# EAGLE design M706X (EAGLE 6.6.0)
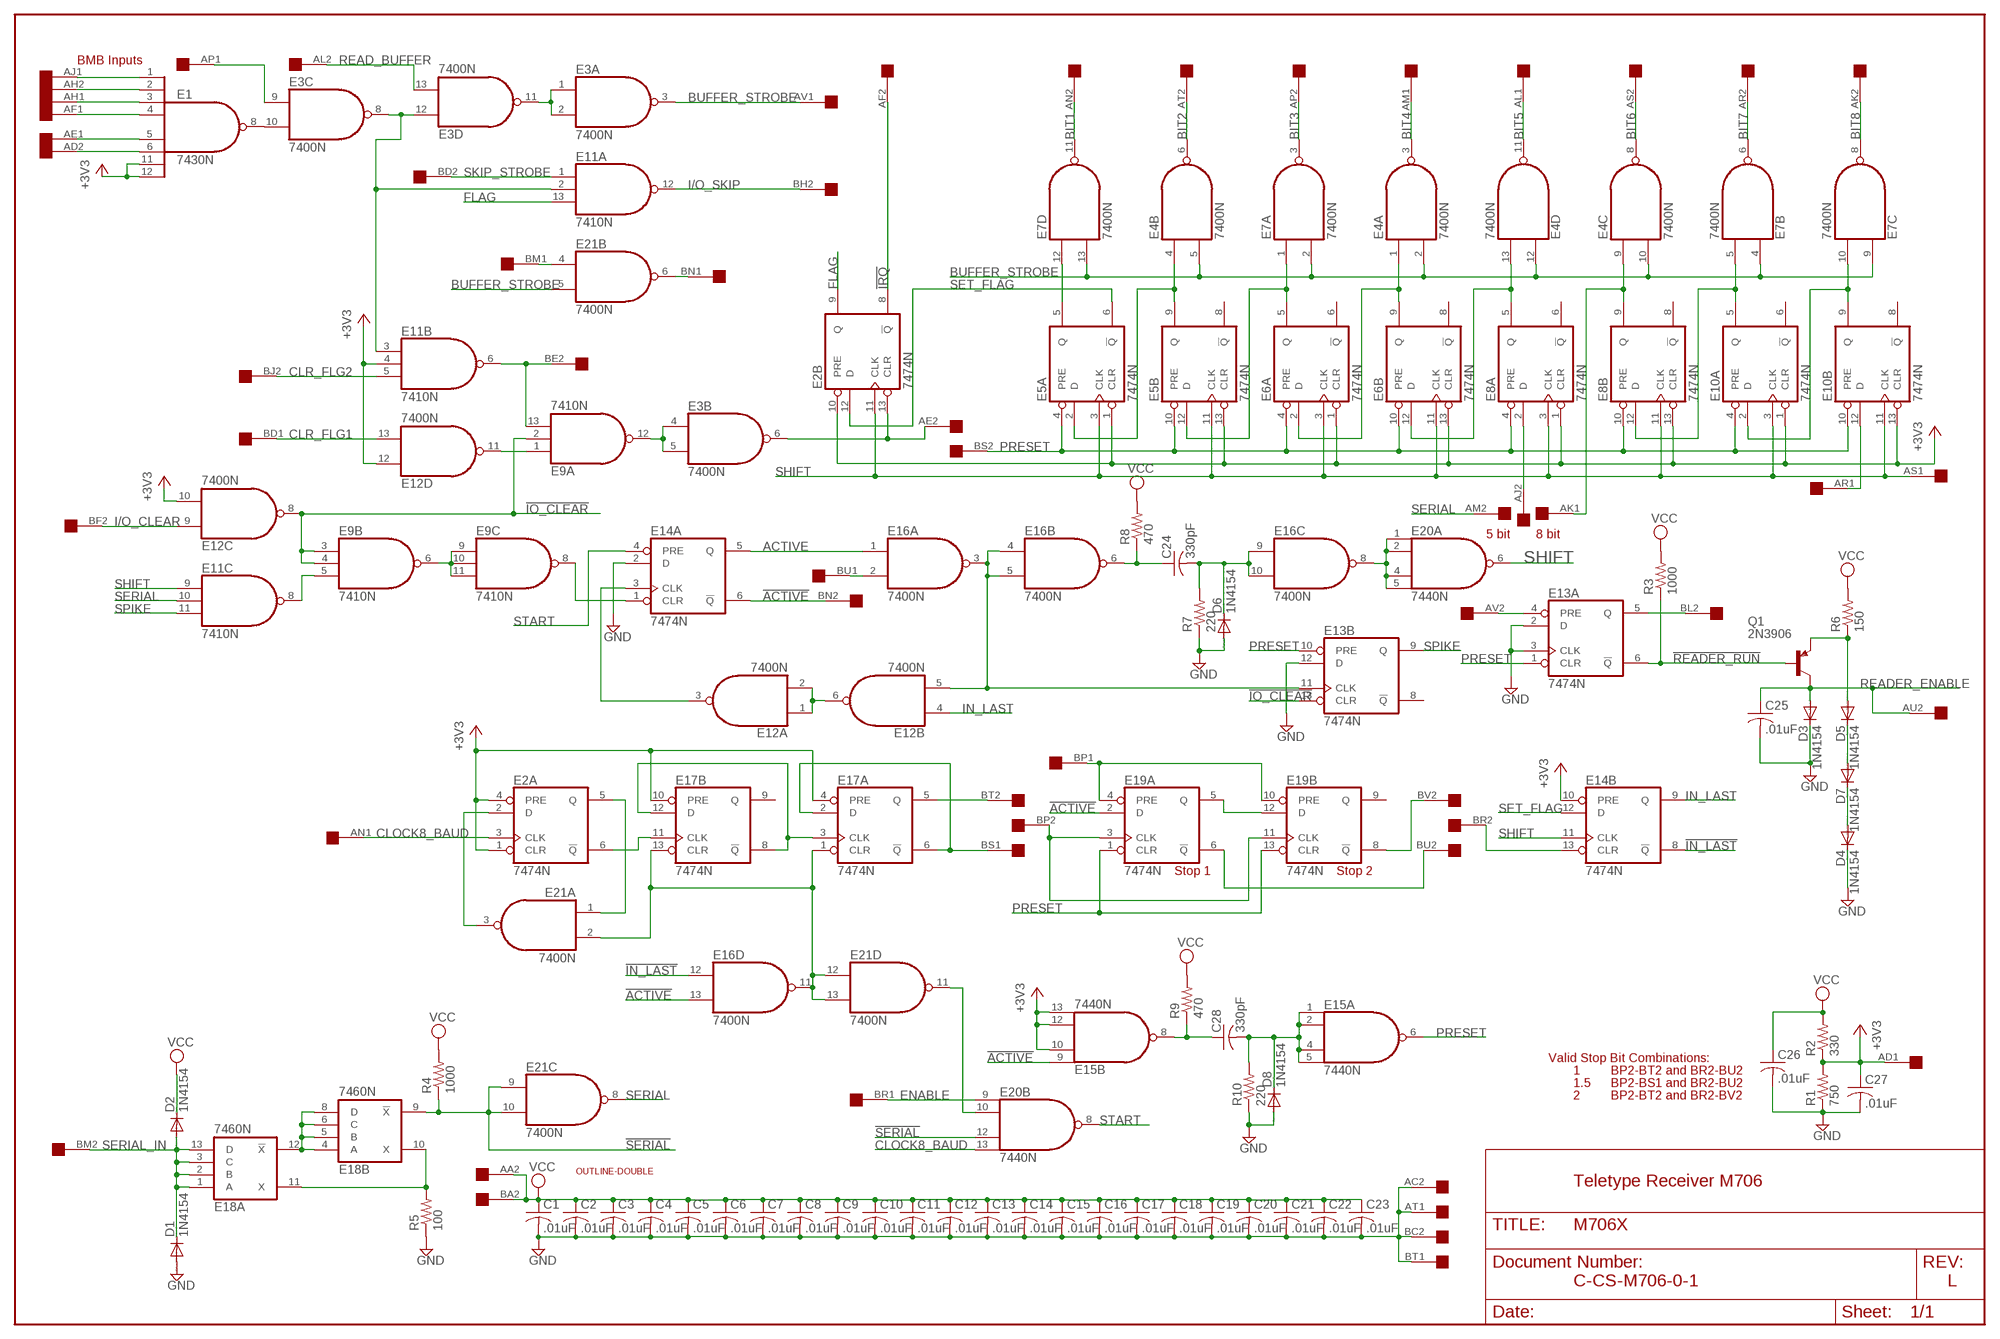
[diagram p0: schematic, sheet 1]

## Parts
C1  .01uF  C-US050-025X075  [C050-025X075]
C2  .01uF  C-US050-025X075  [C050-025X075]
C3  .01uF  C-US050-025X075  [C050-025X075]
C4  .01uF  C-US050-025X075  [C050-025X075]
C5  .01uF  C-US050-025X075  [C050-025X075]
C6  .01uF  C-US050-025X075  [C050-025X075]
C7  .01uF  C-US050-025X075  [C050-025X075]
C8  .01uF  C-US050-025X075  [C050-025X075]
C9  .01uF  C-US050-025X075  [C050-025X075]
C10  .01uF  C-US050-025X075  [C050-025X075]
C11  .01uF  C-US050-025X075  [C050-025X075]
C12  .01uF  C-US050-025X075  [C050-025X075]
C13  .01uF  C-US050-025X075  [C050-025X075]
C14  .01uF  C-US050-025X075  [C050-025X075]
C15  .01uF  C-US050-025X075  [C050-025X075]
C16  .01uF  C-US050-025X075  [C050-025X075]
C17  .01uF  C-US050-025X075  [C050-025X075]
C18  .01uF  C-US050-025X075  [C050-025X075]
C19  .01uF  C-US050-025X075  [C050-025X075]
C20  .01uF  C-US050-025X075  [C050-025X075]
C21  .01uF  C-US050-025X075  [C050-025X075]
C22  .01uF  C-US050-025X075  [C050-025X075]
C23  .01uF  C-US050-025X075  [C050-025X075]
C24  330pF  C-US050-025X075  [C050-025X075]
C25  .01uF  C-US050-025X075  [C050-025X075]
C26  .01uF  C-US050-025X075  [C050-025X075]
C27  .01uF  C-US050-025X075  [C050-025X075]
C28  330pF  C-US050-025X075  [C050-025X075]
D1  1N4154  1N4148DO35-10  [DO35-10]
D2  1N4154  1N4148DO35-10  [DO35-10]
D3  1N4154  1N4148DO35-10  [DO35-10]
D4  1N4154  1N4148DO35-10  [DO35-10]
D5  1N4154  1N4148DO35-10  [DO35-10]
D6  1N4154  1N4148DO35-10  [DO35-10]
D7  1N4154  1N4148DO35-10  [DO35-10]
D8  1N4154  1N4148DO35-10  [DO35-10]
E1  7430N  [DIL14]
E2  7474N  74S74N  [DIL14]
E3  7400N  [DIL14]
E4  7400N  [DIL14]
E5  7474N  74S74N  [DIL14]
E6  7474N  74S74N  [DIL14]
E7  7400N  [DIL14]
E8  7474N  74S74N  [DIL14]
E9  7410N  [DIL14]
E10  7474N  74S74N  [DIL14]
E11  7410N  [DIL14]
E12  7400N  [DIL14]
E13  7474N  74S74N  [DIL14]
E14  7474N  74S74N  [DIL14]
E15  7440N  74S20N  [DIL14]
E16  7400N  [DIL14]
E17  7474N  74S74N  [DIL14]
E18  7460N  [DIL14]
E19  7474N  74S74N  [DIL14]
E20  7440N  74S20N  [DIL14]
E21  7400N  [DIL14]
Q1  2N3906  2N2904  [TO39]
R1  750  R-US_0207/10  [0207/10]
R2  330  R-US_0207/10  [0207/10]
R3  1000  R-US_0207/10  [0207/10]
R4  1000  R-US_0207/10  [0207/10]
R5  100  R-US_0207/10  [0207/10]
R6  150  R-US_0207/10  [0207/10]
R7  220  R-US_0207/10  [0207/10]
R8  470  R-US_0207/10  [0207/10]
R9  470  R-US_0207/10  [0207/10]
R10  220  R-US_0207/10  [0207/10]
U$1  OUTLINE-DOUBLE  [DOUBLE]
U$2  DOUBLE  [EDGE-CON4]

## Nets
2^0: E2.5(A:Q) E21.1(A:I0)
!ACTIVE: E14.6(A:!Q) E15.9(B:I0) E16.13(D:I1) E19.2(A:D) U$2.BN2
!IN_LAST: E14.8(B:!Q) E16.12(D:I0)
!IO_CLEAR: E9.2(A:I1) E9.3(B:I0) E9.4(B:I1) E12.8(C:O) E13.13(B:CLR)
!IRQ: E2.8(B:!Q) U$2.AF2
!READER_RUN: E13.6(A:!Q) Q1.2(B) R3.1
!SERIAL: E18.9(B:!X) E20.12(B:I2) E21.9(C:I0) E21.10(C:I1) R4.1
+3V3: C27.1 E1.11(I6) E1.12(I7) E2.1(A:CLR) E2.4(A:PRE) E2.10(B:PRE) E5.1(A:CLR) E5.13(B:CLR) E6.1(A:CLR) E6.13(B:CLR) E8.1(A:CLR) E8.13(B:CLR) E10.1(A:CLR) E10.13(B:CLR) E11.4(B:I1) E12.10(C:I1) E12.12(D:I0) E14.10(B:PRE) E15.10(B:I1) E15.12(B:I2) E15.13(B:I3) E17.4(A:PRE) E17.10(B:PRE) R1.2 R2.1 U$2.AD1
ACTIVE: E14.5(A:Q) E16.1(A:I0)
BIT1: E7.11(D:O) U$2.AN2
BIT2: E4.6(B:O) U$2.AT2
BIT3: E7.3(A:O) U$2.AP2
BIT4: E4.3(A:O) U$2.AM1
BIT5: E4.11(D:O) U$2.AL1
BIT6: E4.8(C:O) U$2.AS2
BIT7: E7.6(B:O) U$2.AR2
BIT8: E7.8(C:O) U$2.AK2
BUFFER_STROBE: E3.3(A:O) E4.2(A:I1) E4.5(B:I1) E4.10(C:I1) E4.12(D:I0) E7.2(A:I1) E7.4(B:I0) E7.9(C:I0) E7.13(D:I1) E21.5(B:I1) U$2.AV1
CLOCK8_BAUD: E2.3(A:CLK) E20.13(B:I3) U$2.AN1
CLR_FLG1: E12.13(D:I1) U$2.BD1
CLR_FLG2: E11.5(B:I2) U$2.BJ2
ENABLE: E20.9(B:I0) U$2.BR1
FLAG: E2.9(B:Q) E11.13(A:I2)
GND [Supply]: C1.2 C2.2 C3.2 C4.2 C5.2 C6.2 C7.2 C8.2 C9.2 C10.2 C11.2 C12.2 C13.2 C14.2 C15.2 C16.2 C17.2 C18.2 C19.2 C20.2 C21.2 C22.2 C23.2 C25.2 C26.2 C27.2 D1.A D3.C D4.C D6.A D8.A E13.2(A:D) E13.3(A:CLK) E13.12(B:D) E14.2(A:D) R1.1 R5.1 R7.1 R10.1 U$2.AC2 U$2.AT1 U$2.BC2 U$2.BT1
I/O_CLEAR: E12.9(C:I0) U$2.BF2
I/O_SKIP: E11.12(A:O) U$2.BH2
IN_LAST: E12.4(B:I0) E14.9(B:Q)
N$1: E20.10(B:I1) E21.11(D:O)
N$2: E7.5(B:I1) E8.12(B:D) E10.5(A:Q)
N$3: E7.10(C:I1) E10.2(A:D) E10.9(B:Q)
N$4: E4.9(C:I0) E8.9(B:Q) U$2.AK1
N$5: E5.12(B:D) E6.5(A:Q) E7.1(A:I0)
N$6: E4.1(A:I0) E6.2(A:D) E6.9(B:Q)
N$7: E4.13(D:I1) E6.12(B:D) E8.5(A:Q)
N$8: E5.5(A:Q) E7.12(D:I0)
N$9: E4.4(B:I0) E5.2(A:D) E5.9(B:Q)
N$10: E1.8(O) E3.10(C:I1)
N$11: E2.13(B:CLR) E3.6(B:O) U$2.AE2
N$12: E3.4(B:I0) E3.5(B:I1) E9.12(A:O)
N$13: E12.3(A:O) E14.3(A:CLK)
N$14: E10.12(B:D) U$2.AR1
N$15: E1.1(I0) U$2.AJ1
N$16: E3.9(C:I0) U$2.AP1
N$17: E1.6(I5) U$2.AD2
N$18: E1.5(I4) U$2.AE1
N$19: E1.4(I3) U$2.AF1
N$20: E1.3(I2) U$2.AH1
N$21: E1.2(I1) U$2.AH2
N$22: E3.1(A:I0) E3.2(A:I1) E3.11(D:O)
N$23: E3.8(C:O) E3.12(D:I0) E11.2(A:I1) E11.3(B:I0)
N$24: E9.1(A:I0) E12.11(D:O)
N$25: E9.13(A:I2) E11.6(B:O) U$2.BE2
N$26: E16.8(C:O) E20.1(A:I0) E20.2(A:I1) E20.4(A:I2) E20.5(A:I3)
N$27: E2.2(A:D) E21.3(A:O)
N$28: E9.5(B:I2) E11.8(C:O)
N$29: E9.6(B:O) E9.9(C:I0) E9.10(C:I1) E9.11(C:I2)
N$31: E8.2(A:D) U$2.AJ2
N$32: E9.8(C:O) E14.1(A:CLR)
N$33: E2.6(A:!Q) E17.11(B:CLK)
N$34: E17.3(A:CLK) E17.8(B:!Q) E17.12(B:D)
N$35: E17.5(A:Q) U$2.BT2
N$36: E17.2(A:D) E17.6(A:!Q) U$2.BS1
N$37: E19.3(A:CLK) E19.11(B:CLK) U$2.BP2
N$38: E18.4(B:A) E18.5(B:B) E18.6(B:C) E18.8(B:D) E18.12(A:!X)
N$39: E18.10(B:X) E18.11(A:X) R5.2
N$42: E12.1(A:I0) E12.2(A:I1) E12.6(B:O)
N$43: E12.5(B:I1) E13.11(B:CLK) E16.3(A:O) E16.4(B:I0) E16.5(B:I1)
N$45: E16.11(D:O) E17.1(A:CLR) E17.13(B:CLR) E21.2(A:I1) E21.12(D:I0) E21.13(D:I1)
N$46: E21.6(B:O) U$2.BN1
N$47: E21.4(B:I0) U$2.BM1
N$48: C24.1 E16.6(B:O) R8.1
N$49: C28.2 D8.C E15.1(A:I0) E15.2(A:I1) E15.4(A:I2) E15.5(A:I3) R10.2
N$50: E13.4(A:PRE) U$2.AV2
N$52: E13.5(A:Q) U$2.BL2
N$53: C24.2 D6.C E16.9(C:I0) E16.10(C:I1) R7.2
N$54: D5.A Q1.1(E) R6.1
N$55: D5.C D7.A
N$56: D4.A D7.C
N$57: E14.13(B:CLR) U$2.BR2
N$58: C28.1 E15.8(B:O) R9.1
N$59: E19.6(A:!Q) U$2.BU2
N$60: E19.8(B:!Q) U$2.BV2
N$61: E19.5(A:Q) E19.12(B:D)
N$62: E19.4(A:PRE) E19.10(B:PRE) U$2.BP1
N$63: E16.2(A:I1) U$2.BU1
PRESET: E5.4(A:PRE) E5.10(B:PRE) E6.4(A:PRE) E6.10(B:PRE) E8.4(A:PRE) E8.10(B:PRE) E10.4(A:PRE) E10.10(B:PRE) E13.1(A:CLR) E13.10(B:PRE) E15.6(A:O) E19.1(A:CLR) E19.13(B:CLR) U$2.BS2
READ_BUFFER: E3.13(D:I1) U$2.AL2
READER_ENABLE: C25.1 D3.A Q1.3(C) U$2.AU2
SERIAL: E11.10(C:I1) E21.8(C:O) U$2.AM2
SERIAL_IN: D1.C D2.A E18.1(A:A) E18.2(A:B) E18.3(A:C) E18.13(A:D) U$2.BM2
SET_FLAG: E2.12(B:D) E5.6(A:!Q) E14.12(B:D)
SHIFT: E2.11(B:CLK) E5.3(A:CLK) E5.11(B:CLK) E6.3(A:CLK) E6.11(B:CLK) E8.3(A:CLK) E8.11(B:CLK) E10.3(A:CLK) E10.11(B:CLK) E11.9(C:I0) E14.11(B:CLK) E20.6(A:O) U$2.AS1
SKIP_STROBE: E11.1(A:I0) U$2.BD2
SPIKE: E11.11(C:I2) E13.9(B:Q)
START: E14.4(A:PRE) E20.8(B:O)
VCC [Supply]: C1.1 C2.1 C3.1 C4.1 C5.1 C6.1 C7.1 C8.1 C9.1 C10.1 C11.1 C12.1 C13.1 C14.1 C15.1 C16.1 C17.1 C18.1 C19.1 C20.1 C21.1 C22.1 C23.1 C26.1 D2.C R2.2 R3.2 R4.2 R6.2 R8.2 R9.2 U$2.AA2 U$2.BA2
Unconnected: E5.8(B:!Q) E6.6(A:!Q) E6.8(B:!Q) E8.6(A:!Q) E8.8(B:!Q) E10.6(A:!Q) E10.8(B:!Q) E13.8(B:!Q) E17.9(B:Q) E19.9(B:Q) U$2.AA1 U$2.AB1 U$2.AB2 U$2.AC1 U$2.AU1 U$2.BA1 U$2.BB1 U$2.BB2 U$2.BC1 U$2.BE1 U$2.BF1 U$2.BH1 U$2.BJ1 U$2.BK1 U$2.BK2 U$2.BL1 U$2.BV1

## Notes on the sheet
- BMB Inputs
- 5 bit | 8 bit
- Stop 1 | Stop 2
- Valid Stop Bit Combinations:
- 1 | BP2-BT2 and BR2-BU2
- 1.5 | BP2-BS1 and BR2-BU2
- 2 | BP2-BT2 and BR2-BV2
- Teletype Receiver M706
- C-CS-M706-0-1 | L

## Power pins joined to a net without a drawn wire
GND: E1.7(GND) E2.7(P:GND) E3.7(P:GND) E4.7(P:GND) E5.7(P:GND) E6.7(P:GND) E7.7(P:GND) E8.7(P:GND) E9.7(P:GND) E10.7(P:GND) E11.7(P:GND) E12.7(P:GND) E13.7(P:GND) E14.7(P:GND) E15.7(P:GND) E16.7(P:GND) E17.7(P:GND) E18.7(P:GND) E19.7(P:GND) E20.7(P:GND) E21.7(P:GND)
VCC: E1.14(VCC) E2.14(P:VCC) E3.14(P:VCC) E4.14(P:VCC) E5.14(P:VCC) E6.14(P:VCC) E7.14(P:VCC) E8.14(P:VCC) E9.14(P:VCC) E10.14(P:VCC) E11.14(P:VCC) E12.14(P:VCC) E13.14(P:VCC) E14.14(P:VCC) E15.14(P:VCC) E16.14(P:VCC) E17.14(P:VCC) E18.14(P:VCC) E19.14(P:VCC) E20.14(P:VCC) E21.14(P:VCC)

## Library data of the parts
C1-C28 = rcl:C-US: CAPACITOR, American symbol
D1-D8 = diode:1N4148: DIODE high speed (Philips)
E1 = 74xx-us:74*30: 8-input NAND gate
E2 E5 E6 E8 E10 E13 E14 E17 E19 = 74xx-us:74*74: Dual D type positive edge triggered FLIP FLOP, preset and clear
E3 E4 E7 E12 E16 E21 = 74xx-us:74*00: Quad 2-input NAND gate
E9 E11 = 74xx-us:74*10: Triple 3-input NAND gate
E15 E20 = 74xx-us:74*20: Dual 4-input NAND gate
E18 = 74xx-us:74*60: Dual 4-input EXPANDER
Q1 = transistor-pnp:2N2904*: PNP Transistror
R1-R10 = rcl:R-US_: RESISTOR, American symbol
U$1 = dec-con:OUTLINE-*: Board outlines for DEC boards.
U$2 = dec-con:DOUBLE: Double-Height DEC board

## Net classes
1 Supply: width 0.813 mm

## Board
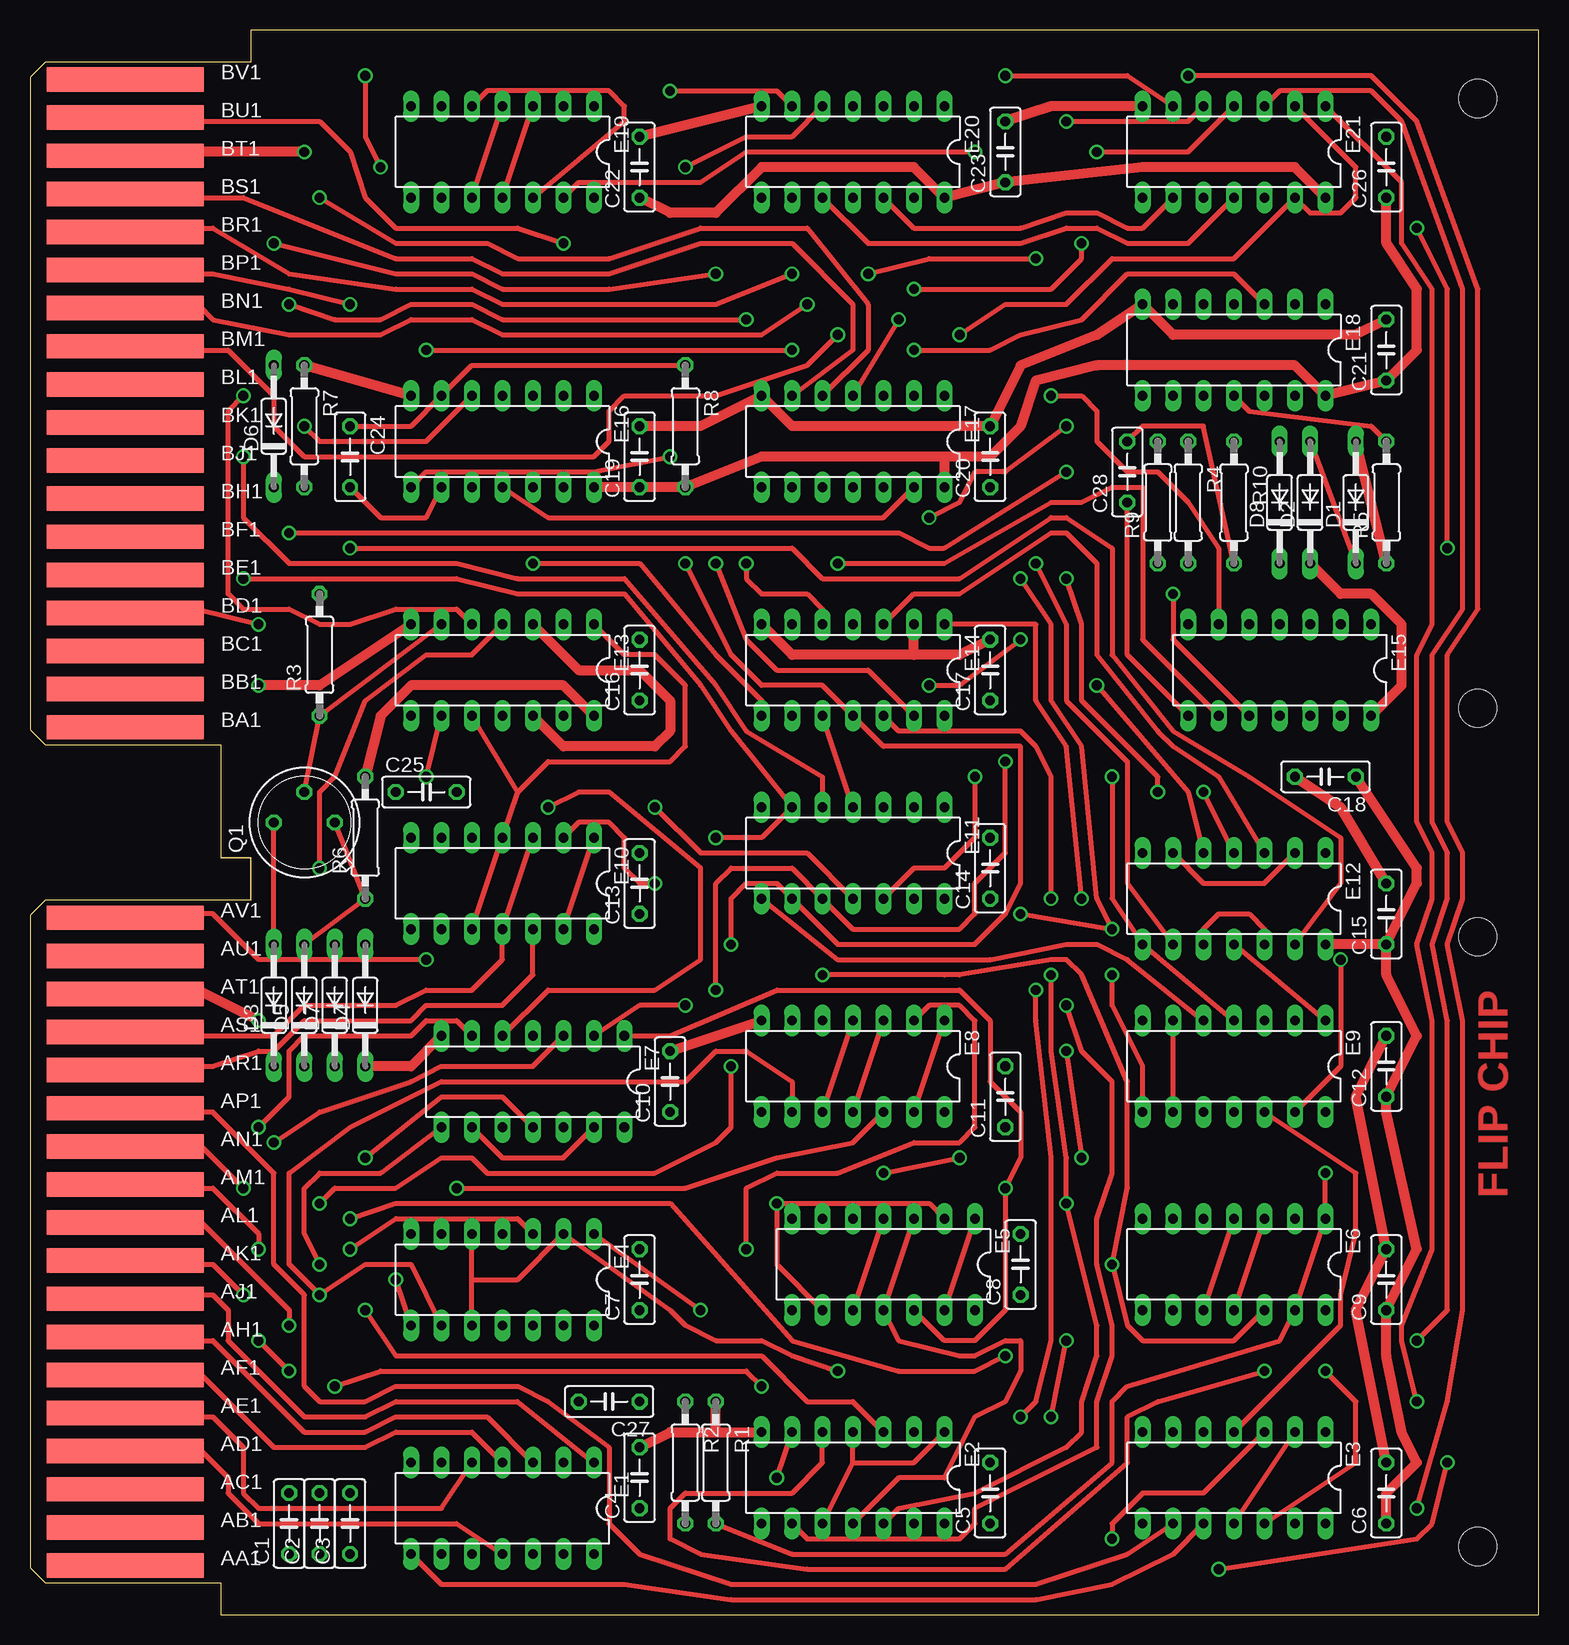
[diagram p1: board, top side]
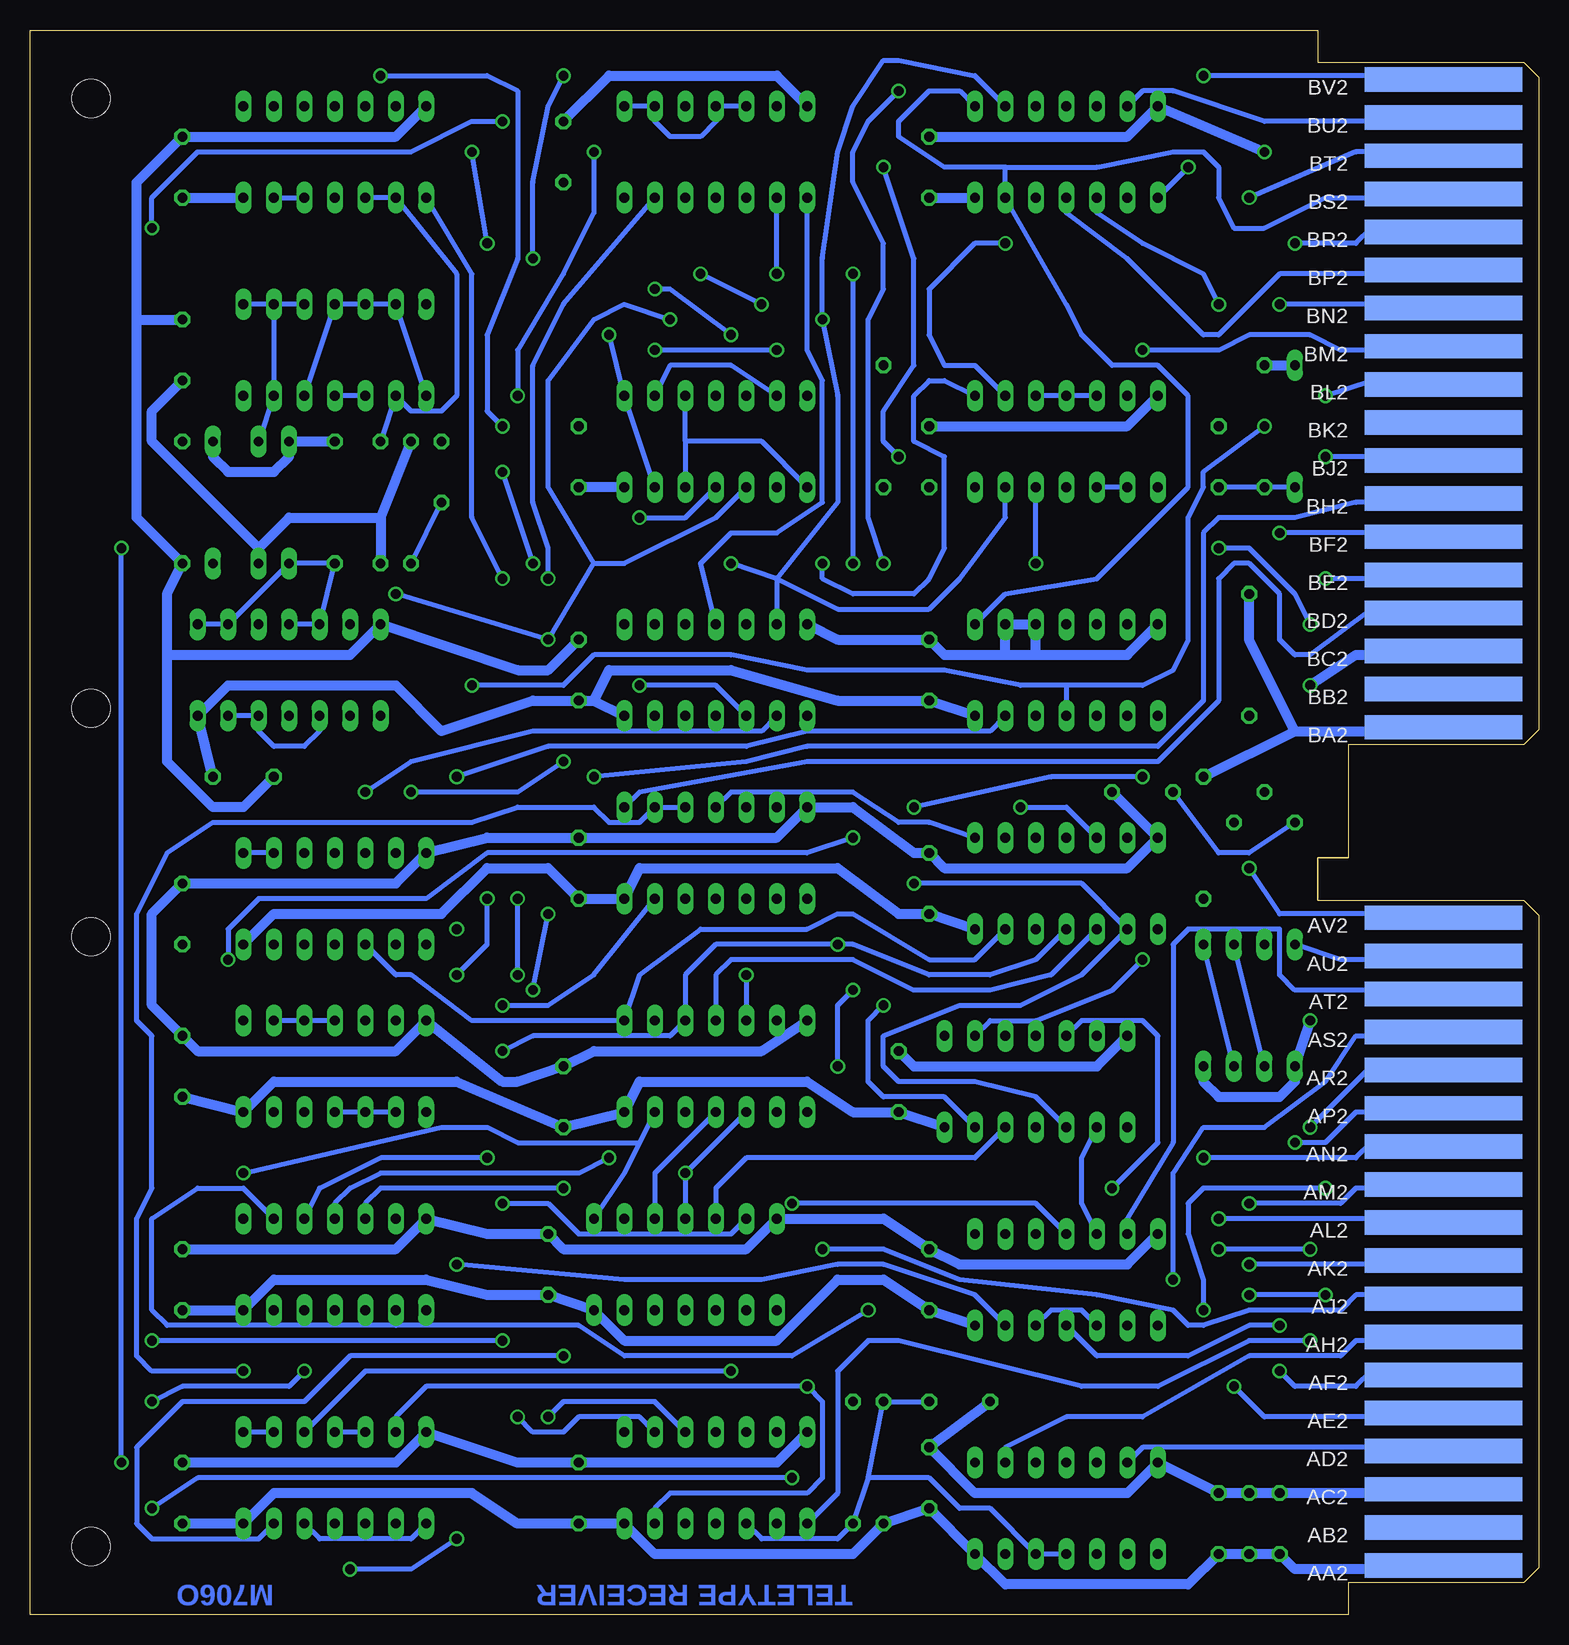
[diagram p2: board, bottom side, seen from below]

Size 125.73 x 132.08 mm. Coordinates in mm from the lower left corner, seen from the top.
Copper layers (1+16): Top 0.035mm / dielectric 1.5mm / Bottom 0.035mm
Design rules "16mils": minimum track width 16mil, minimum drill 32mil, track to track 15mil, track to pad 10mil, pad to pad 10mil, via to via 10mil, smd to smd 10mil, copper to edge 13mil, drill to drill 10mil, minimum pad ring 10mil, minimum via ring 8mil, stop-mask expansion 0mil, vias tented up to drill 0mil, thermal gap 10mil

### Footprints (pad centres in the part's own frame; a part is rotated, then mirrored left to right if it is on the bottom)
C050-025X075 = drill 0.813 octagon: 1 -2.54,0; 2 2.54,0
DO35-10 = drill 0.813 long: A 5.08,0; C -5.08,0
DIL14 = drill 0.813 long: 1 -7.62,-3.81; 2 -5.08,-3.81; 3 -2.54,-3.81; 4 0,-3.81; 5 2.54,-3.81; 6 5.08,-3.81; 7 7.62,-3.81; 8 7.62,3.81; 9 5.08,3.81; 10 2.54,3.81; 11 0,3.81; 12 -2.54,3.81; 13 -5.08,3.81; 14 -7.62,3.81
TO39 = drill 0.813 octagon: 1 0,-2.54; 2 2.54,0; 3 0,2.54
0207/10 = drill 0.813 octagon: 1 -5.08,0; 2 5.08,0
DOUBLE = hole 3.175: 120.65,56.515; 120.65,5.715; 120.65,75.565; 120.65,126.365
EDGE-CON4 = smd 13.106 x 2.032: AA1 7.938,4.128; AB1 7.938,7.303; AC1 7.938,10.477; AD1 7.938,13.652; AE1 7.938,16.828; AF1 7.938,20.003; AH1 7.938,23.177; AJ1 7.938,26.352; AK1 7.938,29.527; AL1 7.938,32.703; AM1 7.938,35.877; AN1 7.938,39.053; AP1 7.938,42.227; AR1 7.938,45.403; AS1 7.938,48.578; AT1 7.938,51.752; AU1 7.938,54.928; AV1 7.938,58.102; BA1 7.938,73.978; BB1 7.938,77.153; BC1 7.938,80.328; BD1 7.938,83.502; BE1 7.938,86.677; BF1 7.938,89.853; BH1 7.938,93.028; BJ1 7.938,96.203; BK1 7.938,99.377; BL1 7.938,102.552; BM1 7.938,105.728; BN1 7.938,108.903; BP1 7.938,112.078; BR1 7.938,115.252; BS1 7.938,118.427; BT1 7.938,121.603; BU1 7.938,124.778; BV1 7.938,127.953 | smd 13.106 x 2.032 bottom: AA2 7.938,4.128; AB2 7.938,7.303; AC2 7.938,10.477; AD2 7.938,13.652; AE2 7.938,16.828; AF2 7.938,20.003; AH2 7.938,23.177; AJ2 7.938,26.352; AK2 7.938,29.527; AL2 7.938,32.703; AM2 7.938,35.877; AN2 7.938,39.053; AP2 7.938,42.227; AR2 7.938,45.403; AS2 7.938,48.578; AT2 7.938,51.752; AU2 7.938,54.928; AV2 7.938,58.102; BA2 7.938,73.978; BB2 7.938,77.153; BC2 7.938,80.328; BD2 7.938,83.502; BE2 7.938,86.677; BF2 7.938,89.853; BH2 7.938,93.028; BJ2 7.938,96.203; BK2 7.938,99.377; BL2 7.938,102.552; BM2 7.938,105.728; BN2 7.938,108.903; BP2 7.938,112.078; BR2 7.938,115.252; BS2 7.938,118.427; BT2 7.938,121.603; BU2 7.938,124.778; BV2 7.938,127.953

### Placement (x,y rotation side)
C1  21.59,7.62 90 top
C2  24.13,7.62 90 top
C3  26.67,7.62 90 top
C4  50.8,11.43 90 top
C5  80.01,10.16 90 top
C6  113.03,10.16 90 top
C7  50.8,27.94 90 top
C8  82.55,29.21 90 top
C9  113.03,27.94 90 top
C10  53.34,44.45 90 top
C11  81.28,43.18 90 top
C12  113.03,45.72 90 top
C13  50.8,60.96 90 top
C14  80.01,62.23 90 top
C15  113.03,58.42 90 top
C16  50.8,78.74 90 top
C17  80.01,78.74 90 top
C18  107.95,69.85 180 top
C19  50.8,96.52 90 top
C20  80.01,96.52 90 top
C21  113.03,105.41 90 top
C22  50.8,120.65 90 top
C23  81.28,121.92 90 top
C24  26.67,96.52 270 top
C25  33.02,68.58 0 top
C26  113.03,120.65 90 top
C27  48.26,17.78 180 top
C28  91.44,95.25 90 top
D1  110.49,92.71 90 top
D2  106.68,92.71 90 top
D3  20.32,50.8 90 top
D4  27.94,50.8 90 top
D5  22.86,50.8 90 top
D6  20.32,99.06 90 top
D7  25.4,50.8 90 top
D8  104.14,92.71 90 top
E1  39.37,8.89 180 top
E2  68.58,11.43 180 top
E3  100.33,11.43 180 top
E4  39.37,27.94 180 top
E5  71.12,29.21 180 top
E6  100.33,29.21 180 top
E7  41.91,44.45 180 top
E8  68.58,45.72 180 top
E9  100.33,45.72 180 top
E10  39.37,60.96 180 top
E11  68.58,63.5 180 top
E12  100.33,59.69 180 top
E13  39.37,78.74 180 top
E14  68.58,78.74 180 top
E15  104.14,78.74 180 top
E16  39.37,97.79 180 top
E17  68.58,97.79 180 top
E18  100.33,105.41 180 top
E19  39.37,121.92 180 top
E20  68.58,121.92 180 top
E21  100.33,121.92 180 top
Q1  22.86,66.04 90 top
R1  57.15,12.7 270 top
R2  54.61,12.7 270 top
R3  24.13,80.01 90 top
R4  96.52,92.71 270 top
R5  113.03,92.71 90 top
R6  27.94,64.77 90 top
R7  22.86,99.06 270 top
R8  54.61,99.06 270 top
R9  93.98,92.71 90 top
R10  100.33,92.71 270 top
U$1  0,0 0 top
U$2  0,0 0 top
U$4  [FLIPCHIP]  125.73,71.12 180 top

### Tracks (layer width: path | path; a pad name or v marks a point on that pad's centre or on a via)
2^0  (via drill 0.81)
  Top 0.406: E2.5 66.04,12.7 63.5,10.16 54.61,10.16 53.34,8.89 53.34,6.35 55.88,5.08 64.77,3.81 81.28,3.81 91.44,12.7 91.44,16.51 93.98,17.78 v102.87,20.32 | v115.57,17.78 114.3,22.86 114.3,24.13 116.84,30.48 116.84,49.53 115.57,55.88 116.84,59.69 116.84,63.5 115.57,66.04 115.57,80.01 116.84,82.55 116.84,110.49 114.3,114.3 114.3,119.38 E21.1
  Bottom 0.406: v102.87,20.32 104.14,19.05 113.03,19.05 v115.57,17.78
!ACTIVE  (via drill 0.81)
  Top 0.406: v67.31,87.63 76.2,87.63 85.09,92.71 87.63,92.71 90.17,93.98 92.71,93.98 92.71,81.28 E15.9 | v21.59,109.22 25.4,107.95 29.21,107.95 31.75,109.22 36.83,109.22 39.37,107.95 v59.69,107.95
  Bottom 0.406: U$2.BN2 8.89,109.22 v21.59,109.22 | E16.13 44.45,91.44 48.26,86.36 50.8,83.82 58.42,83.82 63.5,86.36 | 63.5,86.36 E14.6 | E19.2 46.99,128.27 53.34,129.54 54.61,129.54 57.15,125.73 58.42,121.92 59.69,113.03 v59.69,107.95 58.42,101.6 58.42,92.71 63.5,86.36 | 63.5,86.36 v67.31,87.63
!IN_LAST  (via drill 0.81)
  Top 0.406: v41.91,87.63 50.8,87.63 57.15,80.01 60.96,76.2 E14.8
  Bottom 0.406: v41.91,87.63 E16.12
!IO_CLEAR  (via drill 0.81)
  Top 0.406: E9.4 E12.8 90.17,59.69 v90.17,69.85
  Bottom 0.406: E13.13 45.72,73.66 60.96,73.66 66.04,72.39 82.55,72.39 v90.17,69.85 | E9.2 E9.3 E9.4
!IRQ  (via drill 0.81)
  Top 0.406: v21.59,20.32 v19.05,22.86
  Bottom 0.406: E2.8 58.42,10.16 58.42,20.32 55.88,22.86 53.34,22.86 38.1,19.05 31.75,19.05 24.13,22.86 v19.05,22.86 | U$2.AF2 8.89,20.32 13.97,20.32 15.24,19.05 20.32,19.05 v21.59,20.32
!READER_RUN
  Top 0.406: Q1.2 R3.1 E13.6
!SERIAL
  Top 0.406: E20.12 73.66,115.57 82.55,115.57 86.36,116.84 88.9,116.84 91.44,115.57 92.71,115.57 E21.9
  Bottom 0.406: R4.1 E18.9 93.98,100.33 91.44,100.33 90.17,101.6 90.17,111.76 E21.9 E21.10
+3V3  (via drill 0.81)
  Top 0.406: U$2.AD1 8.89,13.97 13.97,13.97 16.51,11.43 16.51,10.16 19.05,7.62 35.56,7.62 E1.11 | R1.2 63.5,5.08 81.28,5.08 90.17,12.7 90.17,17.78 91.44,19.05 104.14,22.86 E6.13 E6.1 v107.95,36.83 | E2.10 68.58,12.7 | 68.58,12.7 E2.4 | E2.1 73.66,12.7 68.58,12.7 | E12.12 102.87,57.15 101.6,58.42 99.06,58.42 97.79,57.15 E12.10 | E10.13 E10.1 | E5.1 E5.13 | E8.13 E8.1 | v72.39,107.95 E17.4 | E11.4 E14.10 | v95.25,85.09 95.25,81.28 E15.10 | v74.93,77.47 77.47,77.47 v82.55,81.28
  Bottom 0.406: 55.88,11.43 50.8,11.43 48.26,8.89 45.72,8.89 E1.12 E1.11 | 55.88,11.43 R1.2 58.42,6.35 64.77,6.35 E2.10 | 55.88,11.43 R2.1 C27.1 | E10.1 50.8,66.04 53.34,66.04 57.15,68.58 67.31,68.58 E11.4 | E10.13 46.99,54.61 50.8,54.61 57.15,58.42 58.42,58.42 60.96,57.15 69.85,57.15 74.93,53.34 E8.1 88.9,49.53 93.98,53.34 95.25,53.34 E12.10 | E14.10 68.58,77.47 v74.93,77.47 | E5.1 76.2,36.83 74.93,39.37 | 74.93,39.37 E8.13 | 74.93,39.37 85.09,39.37 87.63,40.64 91.44,40.64 v107.95,36.83 | E17.10 68.58,91.44 76.2,87.63 78.74,87.63 | 78.74,87.63 v82.55,81.28 v95.25,85.09 | 78.74,87.63 82.55,93.98 82.55,102.87 78.74,107.95 76.2,109.22 v72.39,107.95 | E15.10 101.6,73.66 102.87,72.39 105.41,72.39 106.68,73.66 E15.12 E15.13
ACTIVE  (via drill 0.81)
  Top 0.406: E14.5 66.04,83.82 64.77,85.09 63.5,85.09 60.96,85.09 59.69,86.36 v59.69,87.63
  Bottom 0.406: E16.1 49.53,102.87 50.8,102.87 52.07,101.6 52.07,97.79 49.53,96.52 49.53,88.9 50.8,86.36 52.07,85.09 57.15,85.09 59.69,86.36 v59.69,87.63
BIT1  (via drill 0.81)
  Top 0.406: v27.94,38.1 34.29,43.18 39.37,43.18 E7.11
  Bottom 0.406: U$2.AN2 8.89,39.37 13.97,39.37 15.24,38.1 v27.94,38.1
BIT2
  Bottom 0.406: U$2.AT2 8.89,52.07 20.32,52.07 21.59,53.34 21.59,57.15 29.21,57.15 30.48,55.88 30.48,39.37 34.29,33.02 E4.6
BIT3  (via drill 0.81)
  Top 0.406: v20.32,39.37 24.13,41.91 31.75,44.45 34.29,45.72 41.91,45.72 E7.3
  Bottom 0.406: U$2.AP2 8.89,41.91 15.24,41.91 17.78,39.37 v20.32,39.37
BIT4  (via drill 0.81)
  Top 0.406: U$2.AM1 8.89,35.56 15.24,35.56 19.05,31.75 v19.05,30.48 | v26.67,30.48 30.48,33.02 40.64,33.02 E4.3
  Bottom 0.406: v19.05,30.48 v26.67,30.48
BIT5  (via drill 0.81)
  Top 0.406: U$2.AL1 8.89,33.02 13.97,33.02 21.59,25.4 v21.59,24.13
  Bottom 0.406: E4.11 36.83,21.59 29.21,21.59 24.13,24.13 v21.59,24.13
BIT6  (via drill 0.81)
  Top 0.406: E4.8 v30.48,27.94
  Bottom 0.406: U$2.AS2 8.89,48.26 15.24,48.26 17.78,44.45 22.86,40.64 27.94,40.64 30.48,36.83 v30.48,27.94
BIT7  (via drill 0.81)
  Top 0.406: v19.05,40.64 21.59,43.18 21.59,46.99 22.86,48.26 31.75,48.26 33.02,49.53 35.56,49.53 E7.6
  Bottom 0.406: U$2.AR2 8.89,45.72 13.97,45.72 v19.05,40.64
BIT8  (via drill 0.81)
  Top 0.406: E7.8 29.21,36.83 24.13,36.83 22.86,35.56 22.86,31.75 v24.13,29.21
  Bottom 0.406: U$2.AK2 8.89,29.21 v24.13,29.21
BUFFER_STROBE  (via drill 0.81)
  Top 0.406: E7.9 39.37,38.1 44.45,38.1 E7.13 | v67.31,20.32 63.5,21.59 60.96,22.86 57.15,22.86 54.61,24.13 53.34,25.4 E4.2 40.64,27.94 36.83,27.94 | E4.10 36.83,27.94 | 36.83,27.94 E4.5 | E3.3 97.79,10.16 92.71,10.16 90.17,7.62 v90.17,6.35 | v99.06,3.81 115.57,6.35 116.84,7.62 v118.11,12.7 | v118.11,88.9 118.11,110.49 v115.57,115.57 | E21.5 96.52,124.46 v86.36,124.46 | v33.02,54.61 19.05,54.61 15.24,58.42 8.89,58.42 U$2.AV1 | E7.2 50.8,50.8 v54.61,50.8
  Bottom 0.406: E4.10 38.1,25.4 40.64,25.4 E4.12 | E4.5 38.1,34.29 38.1,38.1 E7.9 | 41.91,49.53 E7.4 | 41.91,49.53 45.72,49.53 E7.2 | 41.91,49.53 35.56,52.07 v33.02,54.61 | E7.13 49.53,43.18 54.61,43.18 55.88,44.45 55.88,49.53 v54.61,50.8 | v67.31,20.32 97.79,20.32 E3.3 | v90.17,6.35 93.98,3.81 v99.06,3.81 | v86.36,124.46 88.9,124.46 93.98,121.92 111.76,121.92 115.57,118.11 v115.57,115.57 | v118.11,12.7 v118.11,88.9
CLOCK8_BAUD  (via drill 0.81)
  Top 0.406: U$2.AN1 8.89,39.37 13.97,39.37 v17.78,35.56 | E2.3 68.58,17.78 64.77,17.78 60.96,21.59 30.48,21.59 v27.94,25.4 | v83.82,52.07 83.82,49.53 85.09,38.1 85.09,22.86 83.82,17.78 v82.55,16.51 | v82.55,86.36 85.09,82.55 85.09,76.2 87.63,72.39 88.9,59.69 v90.17,57.15 v82.55,58.42
  Bottom 0.406: E2.3 73.66,17.78 81.28,17.78 v82.55,16.51 | E20.13 81.28,109.22 83.82,104.14 83.82,92.71 82.55,88.9 v82.55,86.36 | v17.78,35.56 27.94,35.56 29.21,34.29 29.21,31.75 27.94,27.94 v27.94,25.4 | v83.82,52.07 v82.55,58.42
CLR_FLG1  (via drill 0.81)
  Top 0.406: U$2.BD1 8.89,83.82 13.97,83.82 v19.05,82.55 | v26.67,88.9 63.5,88.9 66.04,86.36 77.47,86.36 85.09,91.44 86.36,91.44 90.17,88.9 90.17,80.01 95.25,73.66 101.6,69.85 109.22,64.77 109.22,60.96 E12.13
  Bottom 0.406: v19.05,82.55 20.32,85.09 24.13,88.9 v26.67,88.9
CLR_FLG2  (via drill 0.81)
  Top 0.406: v17.78,96.52 17.78,91.44 21.59,87.63 35.56,87.63 40.64,86.36 49.53,86.36 57.15,77.47 59.69,73.66 66.04,69.85 E11.5
  Bottom 0.406: U$2.BJ2 8.89,96.52 v17.78,96.52
ENABLE  (via drill 0.81)
  Top 0.406: U$2.BR1 8.89,115.57 15.24,115.57 21.59,111.76 30.48,110.49 36.83,110.49 39.37,109.22 57.15,109.22 v63.5,111.76
  Bottom 0.406: v63.5,111.76 E20.9
FLAG  (via drill 0.81)
  Top 0.406: E2.9 64.77,6.35 77.47,6.35 78.74,7.62 78.74,8.89 88.9,13.97 88.9,17.78 90.17,21.59 90.17,24.13 88.9,29.21 88.9,33.02 90.17,36.83 90.17,44.45 87.63,46.99 v86.36,50.8
  Bottom 0.406: E11.13 78.74,53.34 82.55,50.8 v86.36,50.8
GND  (via drill 0.81)
  Top 0.813: U$2.AT1 8.89,52.07 13.97,52.07 v19.05,49.53 | R5.1 D1.A | 57.15,15.24 53.34,15.24 C4.2 | 57.15,15.24 E2.7 | 57.15,15.24 R1.1 | C6.2 110.49,25.4 C9.2 110.49,43.18 C12.2 | C15.2 109.22,67.31 C18.2 | E7.7 31.75,45.72 D4.C | E8.7 C10.2 | E13.12 44.45,72.39 52.07,72.39 53.34,73.66 53.34,76.2 50.8,78.74 45.72,78.74 E13.3 | v19.05,77.47 24.13,77.47 E13.7 | U$2.BT1 8.89,121.92 v22.86,121.92 | E20.7 C22.2 | E21.7 85.09,125.73 C23.2 | C19.2 55.88,99.06 E17.7 63.5,99.06 C20.2 82.55,104.14 88.9,106.68 E18.7 95.25,106.68 110.49,106.68 C21.2 | E16.7 R7.1 | E14.7 63.5,80.01 73.66,80.01 | 73.66,80.01 77.47,80.01 C17.2 | 73.66,80.01 E14.2
  Bottom 0.813: U$2.AC2 8.26,10.16 C1.2 C2.2 C3.2 E1.7 34.29,10.16 46.99,10.16 C4.2 C27.2 | E7.7 36.83,45.72 52.07,45.72 C10.2 | E4.7 34.29,29.21 48.26,29.21 C7.2 54.61,33.02 E5.7 66.04,30.48 81.28,30.48 C8.2 87.63,31.75 E6.7 95.25,30.48 C9.2 | E13.7 34.29,80.01 41.91,80.01 | 44.45,80.01 49.53,80.01 C16.2 58.42,81.28 E14.7 | 44.45,80.01 41.91,80.01 | E16.7 34.29,99.06 C19.2 | C22.2 34.29,123.19 E19.7 v22.86,121.92 | D4.C 27.94,44.45 26.67,43.18 21.59,43.18 20.32,44.45 D3.C v19.05,49.53 | C25.2 E10.7 34.29,62.23 49.53,62.23 C13.2 52.07,63.5 57.15,67.31 E11.7 63.5,64.77 C14.2 87.63,64.77 E12.7 95.25,60.96 C15.2 115.57,58.42 115.57,50.8 C12.2 111.76,46.99 95.25,46.99 E9.7 86.36,44.45 85.09,44.45 C11.2 78.74,46.99 64.77,46.99 E8.7 | U$2.BC2 8.89,80.01 15.24,80.01 v19.05,77.47 | R7.1 D6.A | E20.7 63.5,128.27 77.47,128.27 C23.2 | R10.1 D8.A 104.14,96.52 105.41,95.25 109.22,95.25 110.49,96.52 D1.A | C17.2 82.55,78.74 85.09,78.74 E15.7 99.06,80.01 114.3,80.01 | C18.2 107.95,67.31 110.49,67.31 114.3,71.12 114.3,80.01 | E21.7 95.25,123.19 C26.2 116.84,119.38 116.84,107.95 | 114.3,80.01 114.3,85.09 R5.1 116.84,91.44 116.84,107.95 | 116.84,107.95 C21.2 | E2.7 63.5,12.7 C5.2 85.09,12.7 E3.7 95.25,12.7 C6.2 | 41.91,80.01 E13.3 E13.2 44.45,80.01
I/O_CLEAR  (via drill 0.81)
  Top 0.406: v21.59,90.17 72.39,90.17 74.93,88.9 76.2,88.9 v86.36,95.25 | v83.82,87.63 86.36,82.55 86.36,76.2 91.44,71.12 91.44,60.96 E12.9
  Bottom 0.406: U$2.BF2 8.89,90.17 v21.59,90.17 | v86.36,95.25 v83.82,87.63
I/O_SKIP  (via drill 0.81)
  Top 0.406: E11.12 73.66,62.23 76.2,62.23 78.74,64.77 v78.74,69.85
  Bottom 0.406: U$2.BH2 8.89,92.71 15.24,92.71 20.32,91.44 26.67,91.44 27.94,90.17 27.94,76.2 31.75,72.39 60.96,72.39 66.04,71.12 v78.74,69.85
IN_LAST  (via drill 0.81)
  Top 0.406: v97.79,68.58 E12.4
  Bottom 0.406: E14.9 64.77,73.66 83.82,73.66 93.98,71.12 v97.79,68.58
N$1
  Top 0.406: E21.11 96.52,114.3 91.44,114.3 88.9,115.57 86.36,115.57 82.55,114.3 69.85,114.3 E20.10
N$2  (via drill 0.81)
  Top 0.406: v35.56,35.56 54.61,35.56 62.23,38.1 68.58,39.37 E8.12 | E7.5 43.18,52.07 52.07,52.07 55.88,54.61 55.88,62.23 48.26,68.58 45.72,68.58 v43.18,67.31
  Bottom 0.406: E7.5 38.1,49.53 33.02,49.53 31.75,48.26 31.75,39.37 v35.56,35.56 | E10.5 39.37,67.31 v43.18,67.31
N$3  (via drill 0.81)
  Top 0.406: E10.2 45.72,66.04 48.26,66.04 49.53,64.77 49.53,62.23 50.8,60.96 v52.07,60.96
  Bottom 0.406: E7.10 41.91,43.18 46.99,44.45 53.34,44.45 54.61,45.72 54.61,48.26 48.26,50.8 43.18,50.8 38.1,53.34 E10.9 38.1,60.96 v52.07,60.96
N$4  (via drill 0.81)
  Top 0.406: U$2.AK1 8.89,29.21 15.24,29.21 v17.78,26.67 | E4.9 31.75,29.21 27.94,29.21 v24.13,26.67 21.59,29.21 21.59,36.83 26.67,40.64 34.29,44.45 54.61,44.45 57.15,46.99 59.69,46.99 63.5,44.45 E8.9
  Bottom 0.406: v17.78,26.67 v24.13,26.67
N$5  (via drill 0.81)
  Top 0.406: E7.1 53.34,48.26 62.23,52.07 77.47,52.07 80.01,49.53 80.01,44.45 82.55,41.91 82.55,38.1 v81.28,35.56 81.28,25.4 78.74,22.86 76.2,22.86 E5.12
  Bottom 0.406: E6.5 97.79,34.29 96.52,35.56 v81.28,35.56
N$6  (via drill 0.81)
  Top 0.406: E4.1 v55.88,25.4
  Bottom 0.406: 95.25,24.13 E6.9 | 95.25,24.13 80.01,24.13 76.2,21.59 62.23,21.59 v55.88,25.4 | 95.25,24.13 114.3,24.13 115.57,25.4 115.57,33.02 111.76,35.56 107.95,35.56 E6.2
N$7  (via drill 0.81)
  Top 0.406: E6.12 100.33,22.86 92.71,22.86 91.44,24.13 v90.17,29.21 91.44,35.56 91.44,44.45 87.63,53.34 86.36,54.61 85.09,54.61 77.47,53.34 76.2,53.34 v66.04,53.34
  Bottom 0.406: E4.13 46.99,26.67 54.61,29.21 58.42,29.21 64.77,27.94 76.2,27.94 v90.17,29.21 | v66.04,53.34 E8.5
N$8
  Bottom 0.406: E5.5 68.58,35.56 66.04,38.1 46.99,38.1 E7.12
N$9  (via drill 0.81)
  Top 0.406: E5.2 74.93,34.29 v62.23,34.29 62.23,29.21 E5.9
  Bottom 0.406: E4.4 41.91,34.29 v62.23,34.29
N$10
  Top 0.406: E1.8 34.29,2.54 49.53,2.54 58.42,1.27 83.82,1.27 90.17,2.54 95.25,5.08 E3.10
N$11  (via drill 0.81)
  Top 0.406: v25.4,19.05 29.21,20.32 59.69,20.32 v60.96,19.05
  Bottom 0.406: U$2.AE2 8.89,16.51 22.86,16.51 v25.4,19.05 | E2.13 73.66,8.89 72.39,10.16 60.96,10.16 59.69,11.43 59.69,17.78 v60.96,19.05 92.71,19.05 95.25,16.51 E3.6
N$12
  Top 0.406: E3.4 109.22,24.13 109.22,26.67 110.49,31.75 110.49,36.83 E9.12
  Bottom 0.406: E3.5 E3.4
N$13
  Top 0.406: E14.3 73.66,85.09 77.47,85.09 85.09,90.17 86.36,90.17 88.9,87.63 88.9,80.01 93.98,73.66 95.25,72.39 99.06,69.85 E12.3
N$14
  Top 0.406: U$2.AR1 8.89,45.72 15.24,45.72 19.05,46.99 20.32,46.99 22.86,49.53 31.75,49.53 33.02,50.8 39.37,50.8 41.91,53.34 E10.12
N$15
  Top 0.406: E1.1 40.64,17.78 30.48,17.78 27.94,16.51 22.86,16.51 16.51,22.86 16.51,25.4 15.24,26.67 8.89,26.67 U$2.AJ1
N$16
  Top 0.406: E3.9 91.44,5.08 83.82,2.54 58.42,2.54 50.8,5.08 48.26,7.62 48.26,13.97 43.18,17.78 40.64,19.05 30.48,19.05 27.94,17.78 24.13,17.78 22.86,19.05 22.86,26.67 20.32,29.21 20.32,36.83 15.24,41.91 8.89,41.91 U$2.AP1
N$17
  Bottom 0.406: U$2.AD2 8.89,13.97 33.02,13.97 E1.6
N$18
  Top 0.406: U$2.AE1 8.89,16.51 15.24,16.51 17.78,13.97 17.78,10.16 19.05,8.89 34.29,8.89 E1.5
N$19
  Top 0.406: U$2.AF1 8.89,20.32 13.97,20.32 20.32,13.97 27.94,13.97 30.48,15.24 36.83,15.24 E1.4
N$20
  Top 0.406: U$2.AH1 8.89,22.86 15.24,22.86 22.86,15.24 27.94,15.24 30.48,16.51 38.1,16.51 E1.3
N$21
  Bottom 0.406: E1.2 44.45,13.97 39.37,16.51 33.02,16.51 24.13,21.59 16.51,21.59 15.24,22.86 8.89,22.86 U$2.AH2
N$22
  Top 0.406: E3.11 E3.2
  Bottom 0.406: E3.2 E3.1
N$23  (via drill 0.81)
  Top 0.406: v107.95,20.32 110.49,17.78 110.49,12.7 E3.12
  Bottom 0.406: E3.8 93.98,6.35 101.6,6.35 E3.12 | v107.95,20.32 115.57,20.32 116.84,21.59 116.84,33.02 115.57,35.56 115.57,48.26 116.84,49.53 116.84,58.42 114.3,63.5 110.49,66.04 88.9,66.04 85.09,67.31 78.74,67.31 77.47,66.04 74.93,66.04 E11.2 E11.3
N$24
  Top 0.406: E9.1 E12.11
N$25  (via drill 0.81)
  Top 0.406: v57.15,64.77 60.96,64.77 E11.6 58.42,73.66 55.88,77.47 49.53,85.09 40.64,85.09 35.56,86.36 v17.78,86.36 | E9.13 109.22,45.72 v109.22,54.61
  Bottom 0.406: U$2.BE2 8.89,86.36 v17.78,86.36 | v57.15,64.77 60.96,63.5 87.63,63.5 92.71,59.69 106.68,59.69 109.22,57.15 v109.22,54.61
N$26  (via drill 0.81)
  Top 0.406: v54.61,120.65 59.69,123.19 63.5,123.19 E20.5 | E16.8 33.02,95.25 46.99,95.25 v53.34,96.52
  Bottom 0.406: E20.1 E20.2 73.66,124.46 72.39,123.19 69.85,123.19 68.58,124.46 E20.4 E20.5 | v53.34,96.52 54.61,97.79 54.61,100.33 52.07,104.14 52.07,113.03 v54.61,120.65
N$27  (via drill 0.81)
  Top 0.406: v85.09,16.51 v86.36,22.86 | v115.57,22.86 118.11,25.4 118.11,49.53 116.84,55.88 118.11,59.69 118.11,63.5 116.84,66.04 116.84,80.01 119.38,83.82 119.38,110.49 114.3,124.46 111.76,127 104.14,127 E21.3
  Bottom 0.406: E2.2 74.93,16.51 80.01,16.51 81.28,15.24 83.82,15.24 v85.09,16.51 | v86.36,22.86 v115.57,22.86
N$28
  Top 0.406: E11.8 67.31,54.61 80.01,54.61 86.36,55.88 88.9,55.88 91.44,54.61 E9.5
N$29
  Top 0.406: E9.9 E9.6
  Bottom 0.406: E9.9 E9.10 E9.11
N$31  (via drill 0.81)
  Top 0.406: v59.69,30.48 59.69,35.56 62.23,36.83 67.31,36.83 73.66,39.37 77.47,39.37 78.74,40.64 78.74,49.53 77.47,50.8 74.93,50.8 E8.2
  Bottom 0.406: U$2.AJ2 8.89,26.67 15.24,26.67 16.51,25.4 24.13,25.4 27.94,24.13 29.21,24.13 30.48,25.4 36.83,26.67 48.26,27.94 54.61,30.48 v59.69,30.48
N$32  (via drill 0.81)
  Top 0.406: E9.8 92.71,45.72 90.17,50.8 v90.17,53.34 | E14.1 83.82,82.55 83.82,76.2 86.36,72.39 v87.63,59.69
  Bottom 0.406: v87.63,59.69 87.63,55.88 v90.17,53.34
N$33  (via drill 0.81)
  Top 0.406: v115.57,8.89 118.11,17.78 119.38,25.4 119.38,49.53 118.11,55.88 119.38,59.69 119.38,63.5 118.11,66.04 118.11,80.01 120.65,83.82 120.65,110.49 115.57,124.46 111.76,128.27 v96.52,128.27 | v62.23,11.43 E2.6 | v74.93,91.44 77.47,92.71 78.74,95.25 81.28,95.25 v86.36,99.06
  Bottom 0.406: E17.11 71.12,91.44 v74.93,91.44 | v62.23,11.43 111.76,11.43 v115.57,8.89 | v86.36,99.06 87.63,100.33 87.63,106.68 85.09,113.03 85.09,127 87.63,128.27 v96.52,128.27
N$34
  Bottom 0.406: E17.8 64.77,97.79 71.12,97.79 | 71.12,97.79 E17.12 | 71.12,97.79 E17.3
N$35  (via drill 0.81)
  Top 0.406: v24.13,118.11 30.48,114.3 38.1,114.3 40.64,113.03 48.26,113.03 55.88,115.57 64.77,115.57 69.85,109.22 69.85,105.41 E17.5
  Bottom 0.406: U$2.BT2 8.89,121.92 15.24,121.92 v24.13,118.11
N$36
  Top 0.406: U$2.BS1 8.89,118.11 17.78,118.11 30.48,113.03 36.83,113.03 39.37,111.76 48.26,111.76 55.88,114.3 63.5,114.3 68.58,109.22 68.58,105.41 E17.6
  Bottom 0.406: E17.6 67.31,104.14 72.39,104.14 E17.2
N$37
  Top 0.406: E19.11 E19.3
  Bottom 0.406: E19.11 39.37,116.84 34.29,113.03 27.94,106.68 26.67,106.68 21.59,111.76 8.89,111.76 U$2.BP2
N$38
  Bottom 0.406: E18.12 E18.4 E18.5 E18.6 E18.8
N$39
  Top 0.406: E18.11 101.6,100.33 111.76,99.06 R5.2
  Bottom 0.406: E18.10 E18.11
N$42
  Top 0.406: E12.6 97.79,60.96 102.87,60.96 E12.2
  Bottom 0.406: E12.2 E12.1
N$43  (via drill 0.81)
  Top 0.406: v22.86,99.06 24.13,97.79 33.02,97.79 E16.5 | v88.9,77.47 96.52,68.58 E12.5
  Bottom 0.406: 39.37,77.47 E13.11 | 39.37,77.47 33.02,77.47 30.48,78.74 29.21,81.28 29.21,91.44 27.94,93.98 27.94,95.25 v22.86,99.06 | 39.37,77.47 43.18,77.47 49.53,78.74 60.96,78.74 67.31,80.01 78.74,80.01 81.28,77.47 v88.9,77.47 | E16.5 E16.4 E16.3
N$45  (via drill 0.81)
  Top 0.406: E21.2 110.49,120.65 110.49,118.11 109.22,116.84 106.68,116.84 E21.13 100.33,113.03 90.17,113.03 86.36,109.22 81.28,109.22 v77.47,106.68 | E16.11 43.18,91.44 71.12,91.44 E17.13
  Bottom 0.406: v77.47,106.68 E17.1 E17.13 | E21.13 E21.12
N$46  (via drill 0.81)
  Top 0.406: U$2.BN1 8.89,109.22 13.97,109.22 15.24,107.95 21.59,106.68 29.21,106.68 31.75,107.95 36.83,107.95 39.37,106.68 60.96,106.68 v64.77,109.22 | E21.6 91.44,128.27 v81.28,128.27 | v69.85,111.76 74.93,113.03 v83.82,113.03
  Bottom 0.406: v64.77,109.22 v69.85,111.76 | v83.82,113.03 83.82,119.38 82.55,125.73 v81.28,128.27
N$47  (via drill 0.81)
  Top 0.406: E21.4 96.52,121.92 v88.9,121.92 | U$2.BM1 8.89,105.41 16.51,105.41 20.32,101.6 20.32,99.06 22.86,96.52 46.99,96.52 48.26,97.79 48.26,100.33 49.53,101.6 57.15,101.6 64.77,104.14 v67.31,106.68 | v87.63,114.3 87.63,113.03 85.09,110.49 v73.66,110.49
  Bottom 0.406: v87.63,114.3 v88.9,121.92 | v67.31,106.68 72.39,110.49 v73.66,110.49
N$48
  Top 0.406: R8.1 36.83,104.14 E16.6 31.75,99.06 C24.1
N$49
  Top 0.406: C28.2 92.71,99.06 97.79,99.06 R10.2
  Bottom 0.406: E15.1 E15.2 D8.C R10.2 E15.5 E15.4
N$50  (via drill 0.81)
  Top 0.406: v24.13,62.23 24.13,68.58 25.4,69.85 27.94,76.2 33.02,80.01 36.83,80.01 E13.4
  Bottom 0.406: U$2.AV2 8.89,58.42 21.59,58.42 v24.13,62.23
N$52  (via drill 0.81)
  Top 0.406: v17.78,101.6 16.51,100.33 16.51,85.09 17.78,83.82 21.59,83.82 24.13,82.55 26.67,82.55 30.48,83.82 35.56,83.82 E13.5
  Bottom 0.406: U$2.BL2 8.89,102.87 13.97,102.87 v17.78,101.6
N$53
  Top 0.406: C24.2 29.21,91.44 33.02,91.44 E16.9
  Bottom 0.406: C24.2 R7.2 D6.C | E16.9 E16.10
N$54
  Top 0.406: D5.A R6.1 Q1.1
N$55
  Bottom 0.406: D5.C D7.A
N$56
  Bottom 0.406: D7.C D4.A
N$57  (via drill 0.81)
  Top 0.406: v20.32,114.3 30.48,111.76 36.83,111.76 39.37,110.49 48.26,110.49 v57.15,111.76 | v57.15,87.63 59.69,81.28 62.23,78.74 69.85,78.74 E14.13
  Bottom 0.406: U$2.BR2 8.89,115.57 13.97,115.57 15.24,114.3 v20.32,114.3 | v57.15,111.76 v57.15,87.63
N$58
  Top 0.406: C28.1 91.44,80.01 E15.8
  Bottom 0.406: C28.1 R9.1
N$59
  Bottom 0.406: U$2.BU2 8.89,124.46 22.86,124.46 30.48,127 33.02,127 E19.6
N$60  (via drill 0.81)
  Top 0.406: v29.21,120.65 27.94,123.19 v27.94,128.27
  Bottom 0.406: U$2.BV2 8.89,128.27 v27.94,128.27 | v29.21,120.65 E19.8
N$61
  Top 0.406: E19.5 38.1,127 48.26,127 49.53,125.73 49.53,124.46 E19.12
N$62  (via drill 0.81)
  Top 0.406: U$2.BP1 8.89,111.76 15.24,111.76 21.59,110.49 v26.67,109.22 | E19.10 E19.4
  Bottom 0.406: E19.10 36.83,116.84 33.02,114.3 27.94,111.76 v26.67,109.22
N$63  (via drill 0.81)
  Top 0.406: U$2.BU1 8.89,124.46 24.13,124.46 26.67,121.92 27.94,118.11 30.48,115.57 40.64,115.57 v44.45,114.3
  Bottom 0.406: E16.2 46.99,104.14 49.53,104.14 50.8,106.68 50.8,110.49 46.99,114.3 v44.45,114.3
PRESET  (via drill 0.81)
  Top 0.406: E10.10 E10.4 40.64,68.58 | 40.64,68.58 43.18,71.12 53.34,71.12 54.61,72.39 54.61,77.47 52.07,80.01 49.53,80.01 E13.1 | 40.64,68.58 E13.10 | E5.4 E5.10 | E6.4 E6.10 | E8.4 E8.10 | E15.6 99.06,88.9 96.52,92.71 93.98,95.25 91.44,95.25 88.9,97.79 88.9,100.33 87.63,101.6 v85.09,101.6 | E19.13 45.72,119.38 55.88,119.38 59.69,121.92 v78.74,121.92 | v71.12,36.83 v77.47,38.1
  Bottom 0.406: U$2.BS2 8.89,118.11 17.78,118.11 22.86,115.57 25.4,115.57 26.67,118.11 26.67,120.65 27.94,121.92 30.48,121.92 36.83,120.65 44.45,120.65 | 44.45,120.65 E19.13 39.37,109.22 38.1,106.68 35.56,104.14 31.75,104.14 29.21,101.6 29.21,93.98 36.83,86.36 44.45,85.09 E13.1 | E19.1 48.26,127 50.8,127 53.34,124.46 53.34,123.19 49.53,120.65 44.45,120.65 | E10.10 40.64,53.34 45.72,52.07 52.07,52.07 57.15,54.61 67.31,54.61 68.58,53.34 E8.4 | E5.4 v71.12,36.83 E8.10 | v77.47,38.1 80.01,36.83 96.52,36.83 99.06,35.56 100.33,34.29 E6.4 | v85.09,101.6 85.09,105.41 81.28,111.76 78.74,116.84 v78.74,121.92
READ_BUFFER  (via drill 0.81)
  Top 0.406: v26.67,33.02 30.48,34.29 53.34,34.29 63.5,22.86 72.39,20.32 78.74,20.32 v81.28,21.59
  Bottom 0.406: U$2.AL2 8.89,33.02 v26.67,33.02 | E3.13 106.68,6.35 115.57,6.35 116.84,7.62 116.84,13.97 113.03,17.78 102.87,17.78 99.06,21.59 v81.28,21.59
READER_ENABLE
  Top 0.406: D3.A Q1.3
  Bottom 0.406: U$2.AU2 8.89,54.61 16.51,54.61 D3.A | Q1.3 24.13,63.5 26.67,63.5 C25.1
SERIAL  (via drill 0.81)
  Top 0.406: v24.13,34.29 25.4,35.56 30.48,35.56 34.29,38.1 36.83,38.1 38.1,36.83 52.07,36.83 57.15,39.37 58.42,40.64 v58.42,45.72 | v57.15,52.07 57.15,60.96 58.42,62.23 63.5,62.23 E11.10 68.58,57.15 77.47,57.15 78.74,58.42 78.74,60.96 81.28,63.5 v81.28,71.12 | v86.36,86.36 87.63,82.55 87.63,76.2 93.98,69.85 v93.98,68.58
  Bottom 0.406: U$2.AM2 8.89,35.56 15.24,35.56 16.51,34.29 v24.13,34.29 | E21.8 88.9,111.76 88.9,91.44 v86.36,86.36 | v57.15,52.07 58.42,50.8 v58.42,45.72 | v81.28,71.12 85.09,68.58 v93.98,68.58
SERIAL_IN  (via drill 0.81)
  Top 0.406: D2.A D1.C | v33.02,105.41 v63.5,105.41 | v73.66,105.41 80.01,105.41 82.55,106.68 87.63,107.95 91.44,111.76 100.33,111.76 E18.3
  Bottom 0.406: E18.2 E18.13 D2.A | U$2.BM2 8.89,105.41 16.51,105.41 19.05,106.68 24.13,106.68 26.67,105.41 v33.02,105.41 | E18.3 E18.2 | E18.2 E18.1 | v63.5,105.41 v73.66,105.41
SET_FLAG  (via drill 0.81)
  Top 0.406: E2.12 72.39,8.89 78.74,10.16 86.36,13.97 87.63,15.24 87.63,17.78 88.9,21.59 88.9,24.13 v86.36,34.29 86.36,38.1 85.09,46.99 v85.09,53.34 | E14.12 72.39,73.66 82.55,73.66 83.82,72.39 85.09,69.85 v85.09,59.69
  Bottom 0.406: E5.6 67.31,31.75 80.01,31.75 82.55,34.29 v86.36,34.29 | v85.09,53.34 v85.09,59.69
SHIFT  (via drill 0.81)
  Top 0.406: E2.11 72.39,11.43 76.2,11.43 78.74,16.51 81.28,17.78 82.55,20.32 82.55,22.86 81.28,22.86 78.74,21.59 77.47,21.59 72.39,22.86 E5.11 E5.3 | v86.36,46.99 v87.63,38.1 | U$2.AS1 8.89,48.26 20.32,48.26 22.86,50.8 30.48,50.8 33.02,52.07 36.83,52.07 39.37,54.61 E10.11 E10.3 | v58.42,55.88 58.42,59.69 59.69,60.96 62.23,60.96 E11.9 67.31,55.88 78.74,55.88 81.28,58.42 82.55,60.96 82.55,72.39 71.12,72.39 E14.11 66.04,77.47 60.96,77.47 58.42,80.01 v54.61,87.63 | E6.3 E6.11 | E8.3 E8.11 | v53.34,127 62.23,127 E20.6
  Bottom 0.406: E10.11 41.91,54.61 45.72,53.34 50.8,53.34 57.15,55.88 v58.42,55.88 68.58,55.88 71.12,53.34 E8.3 72.39,48.26 83.82,48.26 v86.36,46.99 | E5.3 73.66,36.83 E8.11 | E6.3 101.6,35.56 96.52,38.1 v87.63,38.1 | v54.61,87.63 55.88,91.44 55.88,107.95 54.61,110.49 54.61,114.3 57.15,119.38 57.15,121.92 55.88,124.46 v53.34,127
SKIP_STROBE
  Bottom 0.406: U$2.BD2 8.89,83.82 13.97,83.82 19.05,80.01 20.32,80.01 21.59,81.28 21.59,85.09 24.13,87.63 25.4,87.63 26.67,86.36 26.67,76.2 31.75,71.12 60.96,71.12 74.93,68.58 E11.1
SPIKE  (via drill 0.81)
  Top 0.406: v33.02,69.85 E13.9 | v52.07,67.31 55.88,63.5 64.77,63.5 E11.11
  Bottom 0.406: v33.02,69.85 40.64,69.85 v52.07,67.31
START
  Bottom 0.406: E20.8 60.96,105.41 59.69,102.87 59.69,92.71 63.5,90.17 67.31,90.17 69.85,87.63 E14.4
VCC
  Top 0.813: C6.1 113.03,10.16 115.57,12.7 114.3,15.24 113.03,21.59 C9.1 115.57,30.48 113.03,41.91 C12.1 115.57,48.26 113.03,53.34 C15.1 | C15.1 E12.14 | C18.1 115.57,62.23 115.57,60.96 C15.1 | C26.1 113.03,114.3 115.57,110.49 115.57,105.41 C21.1 E18.14 105.41,104.14 88.9,104.14 83.82,102.87 82.55,99.06 80.01,96.52 76.2,96.52 | R6.2 29.21,74.93 31.75,77.47 44.45,77.47 E13.14 | E21.14 105.41,120.65 92.71,120.65 C23.1 E20.14 73.66,120.65 60.96,120.65 57.15,116.84 53.34,116.84 C22.1 | E16.14 C19.1 R8.2 60.96,96.52 76.2,96.52 | 76.2,96.52 E17.14 | D2.C 109.22,85.09 111.76,85.09 114.3,82.55 114.3,77.47 E15.14
  Bottom 0.813: U$2.AA2 8.26,3.81 20.32,3.81 C1.1 C2.1 C3.1 29.21,2.54 44.45,2.54 E1.14 C4.1 R2.2 57.15,5.08 73.66,5.08 E2.14 C5.1 85.09,7.62 88.9,10.16 105.41,10.16 E3.14 C6.1 | E4.14 C7.1 54.61,27.94 58.42,27.94 63.5,22.86 76.2,22.86 E5.14 C8.1 87.63,26.67 92.71,27.94 105.41,27.94 E6.14 C9.1 | U$2.BA2 8.89,73.66 20.32,73.66 | R6.2 20.32,73.66 | 20.32,73.66 24.13,81.28 R3.2 | E10.14 C13.1 53.34,58.42 58.42,62.23 74.93,62.23 E11.14 C14.1 82.55,62.23 87.63,62.23 91.44,58.42 105.41,58.42 E12.14 | E13.14 C16.1 58.42,76.2 67.31,78.74 77.47,78.74 78.74,76.2 | 78.74,76.2 C17.1 83.82,76.2 91.44,73.66 95.25,77.47 109.22,77.47 E15.14 C18.1 | 78.74,76.2 E14.14 | E7.14 C10.1 57.15,41.91 60.96,44.45 74.93,44.45 E8.14 C11.1 90.17,44.45 105.41,44.45 E9.14 C12.1 | 96.52,91.44 R4.2 | 96.52,91.44 R9.2 | C26.1 E21.14 | 106.68,88.9 104.14,91.44 96.52,91.44 | D2.C 106.68,88.9 | 106.68,88.9 115.57,97.79 115.57,100.33 C21.1 | E17.14 C20.1 | C22.1 E19.14

### Text on the board
Bottom: TELETYPE RECEIVER | M706O